# EAGLE design Declan (EAGLE 7.5.0)
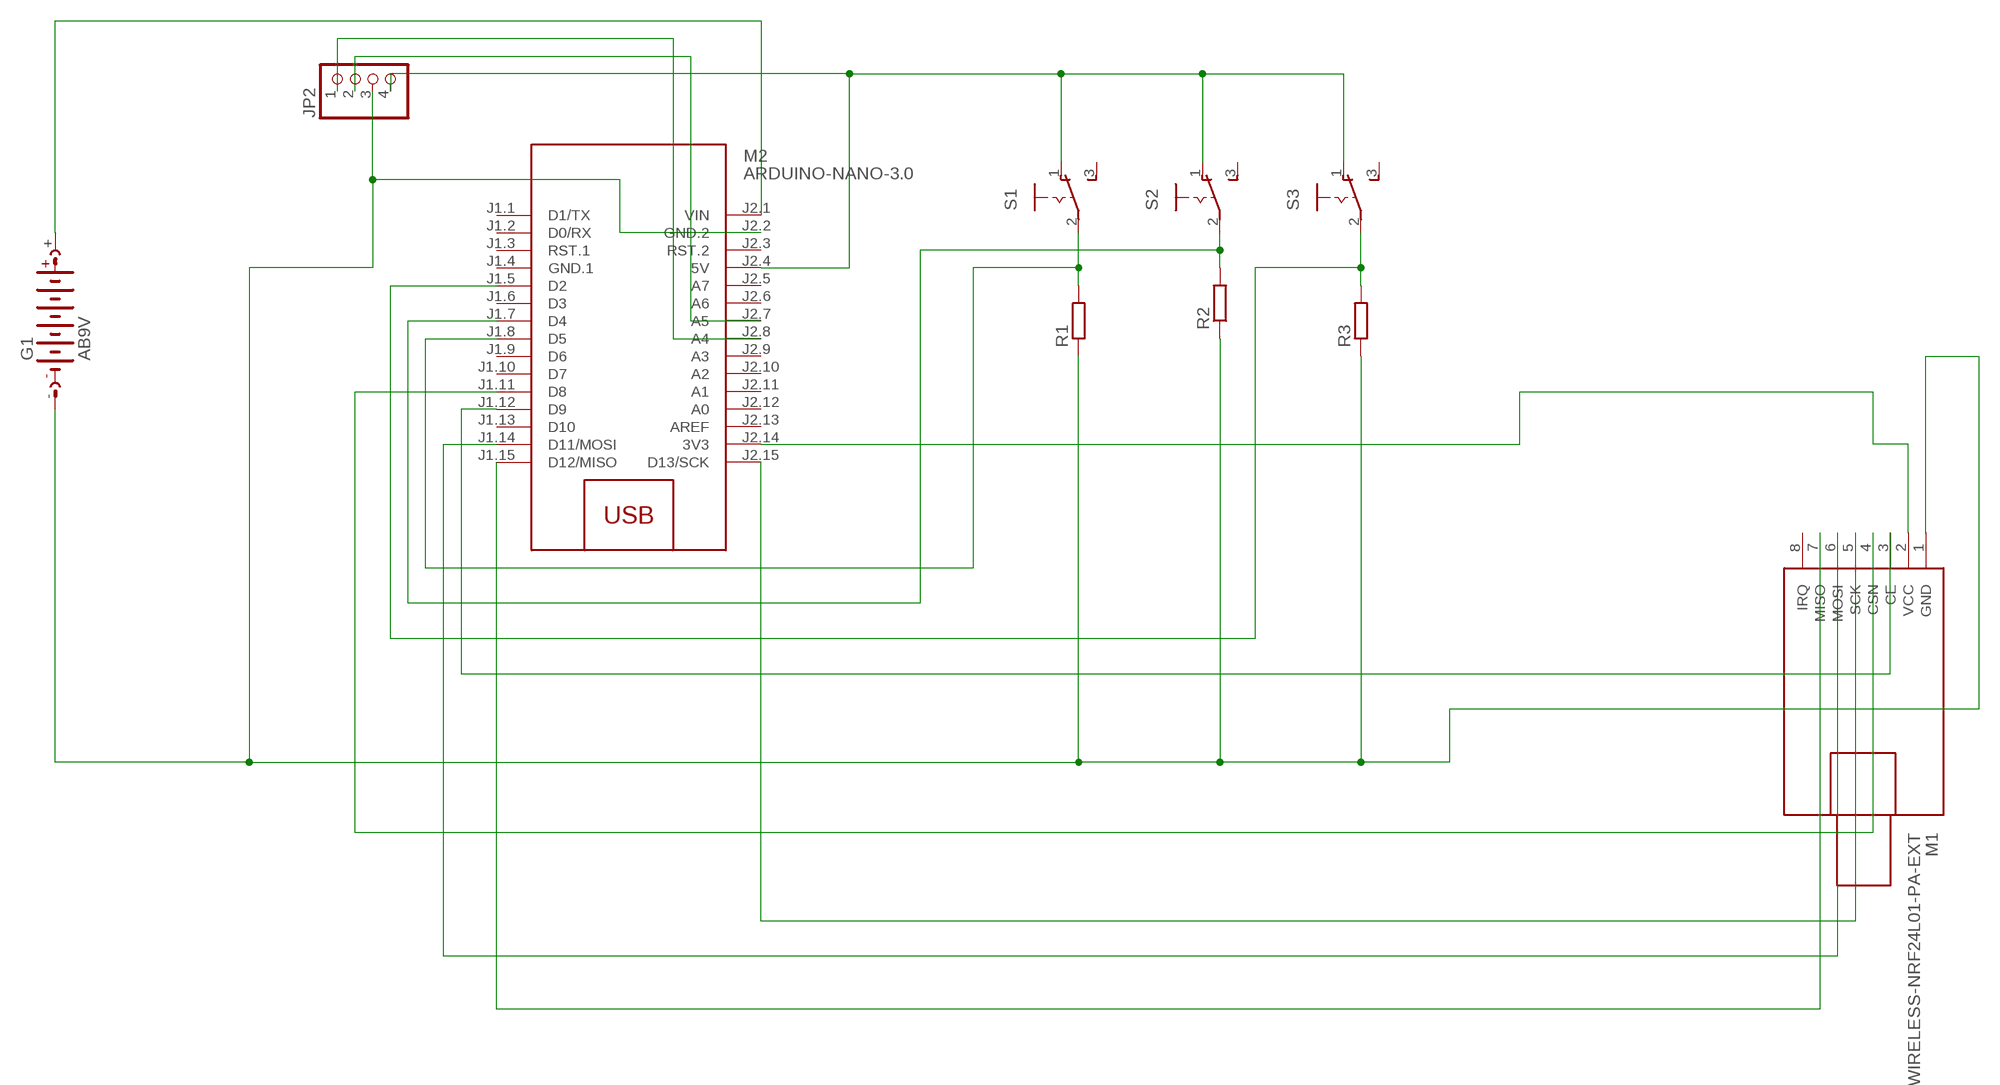
[diagram p0: schematic, sheet 1]

## Parts
G1  AB9V  [AB9V]
JP2  PINHD-1X4  [1X04]
M1  WIRELESS-NRF24L01-PA-EXT  [WIRELESS-NRF24L01-PA-EXT]
M2  ARDUINO-NANO-3.0  [ARDUINO-NANO-3.0]
R1  R-EU_0207/10  [0207/10]
R2  R-EU_0207/10  [0207/10]
R3  R-EU_0207/10  [0207/10]
S1  255SB  [255SB]
S2  255SB  [255SB]
S3  255SB  [255SB]

## Nets
N$1: JP2.2 M2.J2.7(A5)
N$2: JP2.1 M2.J2.8(A4)
N$5: G1.- JP2.3 M1.1(GND) M2.J2.2(GND.2) R1.1 R2.1 R3.1
N$6: JP2.4 M2.J2.4(5V) S1.1(O) S2.1(O) S3.1(O)
N$7: M2.J1.8(D5) R1.2 S1.2(P)
N$8: M2.J1.7(D4) R2.2 S2.2(P)
N$9: M2.J1.5(D2) R3.2 S3.2(P)
N$10: G1.+ M2.J2.1(VIN)
N$11: M1.2(VCC) M2.J2.14(3V3)
N$13: M1.3(CE) M2.J1.12(D9)
N$14: M1.4(CSN) M2.J1.11(D8)
N$15: M1.5(SCK) M2.J2.15(D13/SCK)
N$16: M1.6(MOSI) M2.J1.14(D11/MOSI)
N$17: M1.7(MISO) M2.J1.15(D12/MISO)
Unconnected: M1.8(IRQ) M2.J1.1(D1/TX) M2.J1.2(D0/RX) M2.J1.3(RST.1) M2.J1.6(D3) M2.J1.9(D6) M2.J1.10(D7) M2.J1.13(D10) M2.J2.3(RST.2) M2.J2.5(A7) M2.J2.6(A6) M2.J2.9(A3) M2.J2.10(A2) M2.J2.11(A1) M2.J2.12(A0) M2.J2.13(AREF) S1.3(S) S2.3(S) S3.3(S)

## Power pins joined to a net without a drawn wire
GND.1: M2.J1.4(GND.1)

## Library data of the parts
G1 = battery:AB9V: 9-V BATTERY CLIP
JP2 = pinhead:PINHD-1X4: PIN HEADER
M1 = diy-modules:WIRELESS-NRF24L01-PA-EXT: 2.4 GHz Wireless Module based on NRF24L01 chip with preamplifier and external antenna Click here to find device on ebay.com <http://www.ebay.com/sch/nrf24l01+pa+lna+sma>
M2 = diy-modules:ARDUINO-NANO-3.0: Arduino Nano 3.0 and compatible devices More details available here: https://www.arduino.cc/en/Main/ArduinoBoardNano Click here to find device on ebay.com <http://www.ebay.com/sch/arduino+nano>
R1-R3 = resistor:R-EU_: RESISTOR, European symbol
S1-S3 = switch:255SB: SLIDING SWITCH Distributor Buerklin, 11G810

## Board
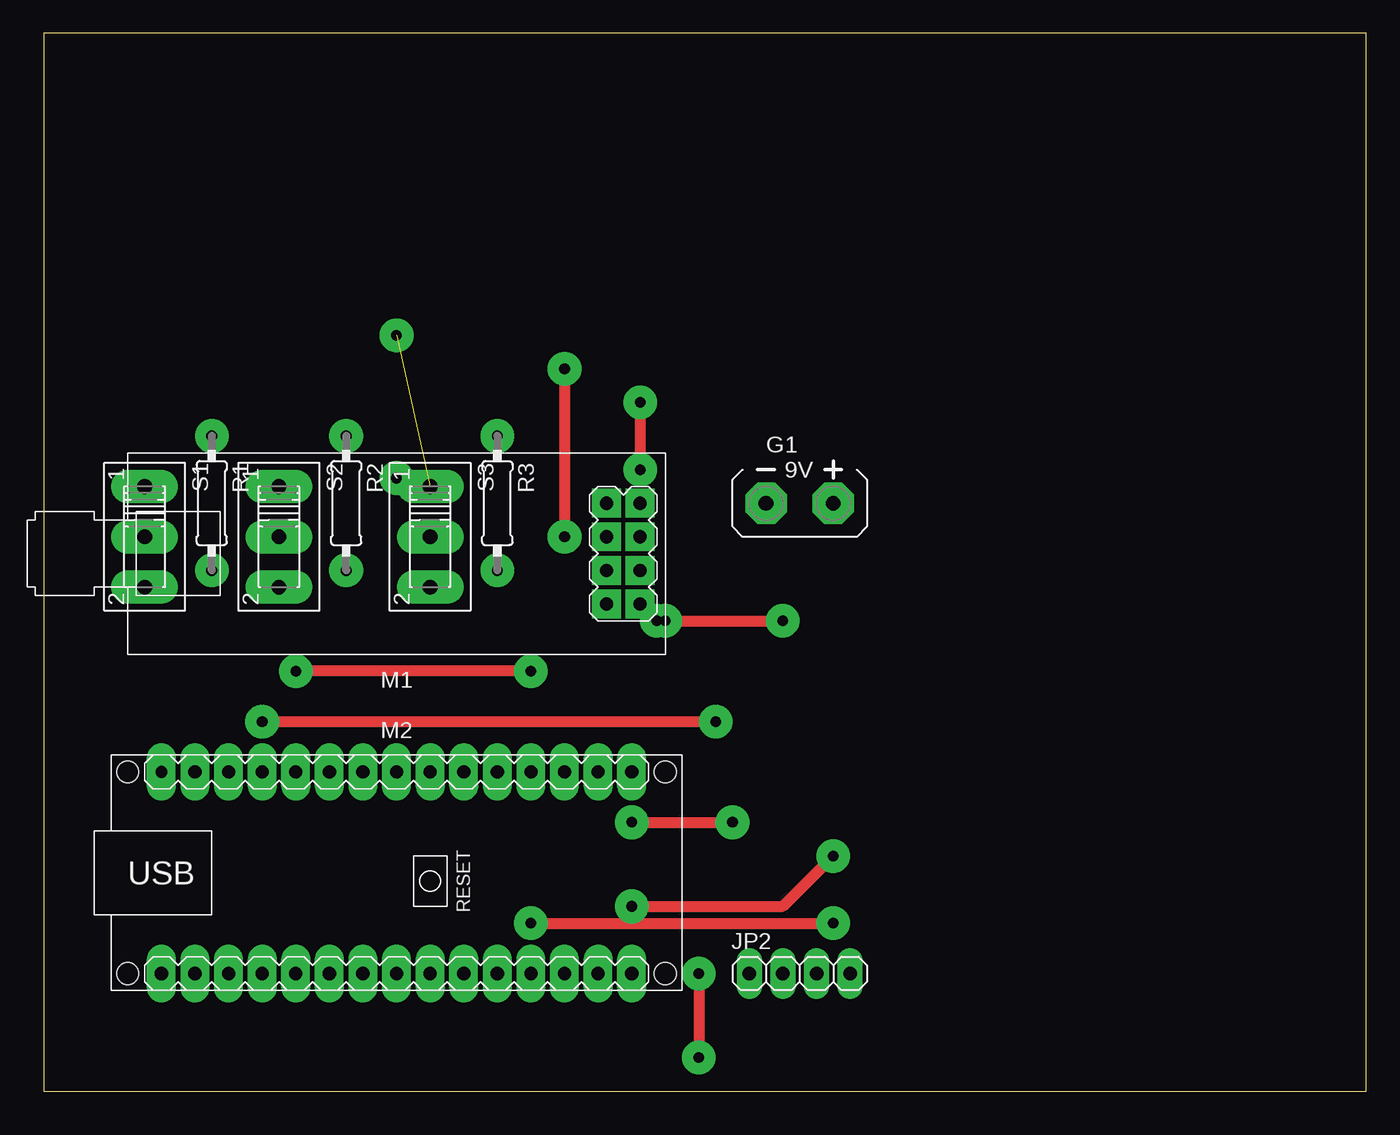
[diagram p1: board, top side]
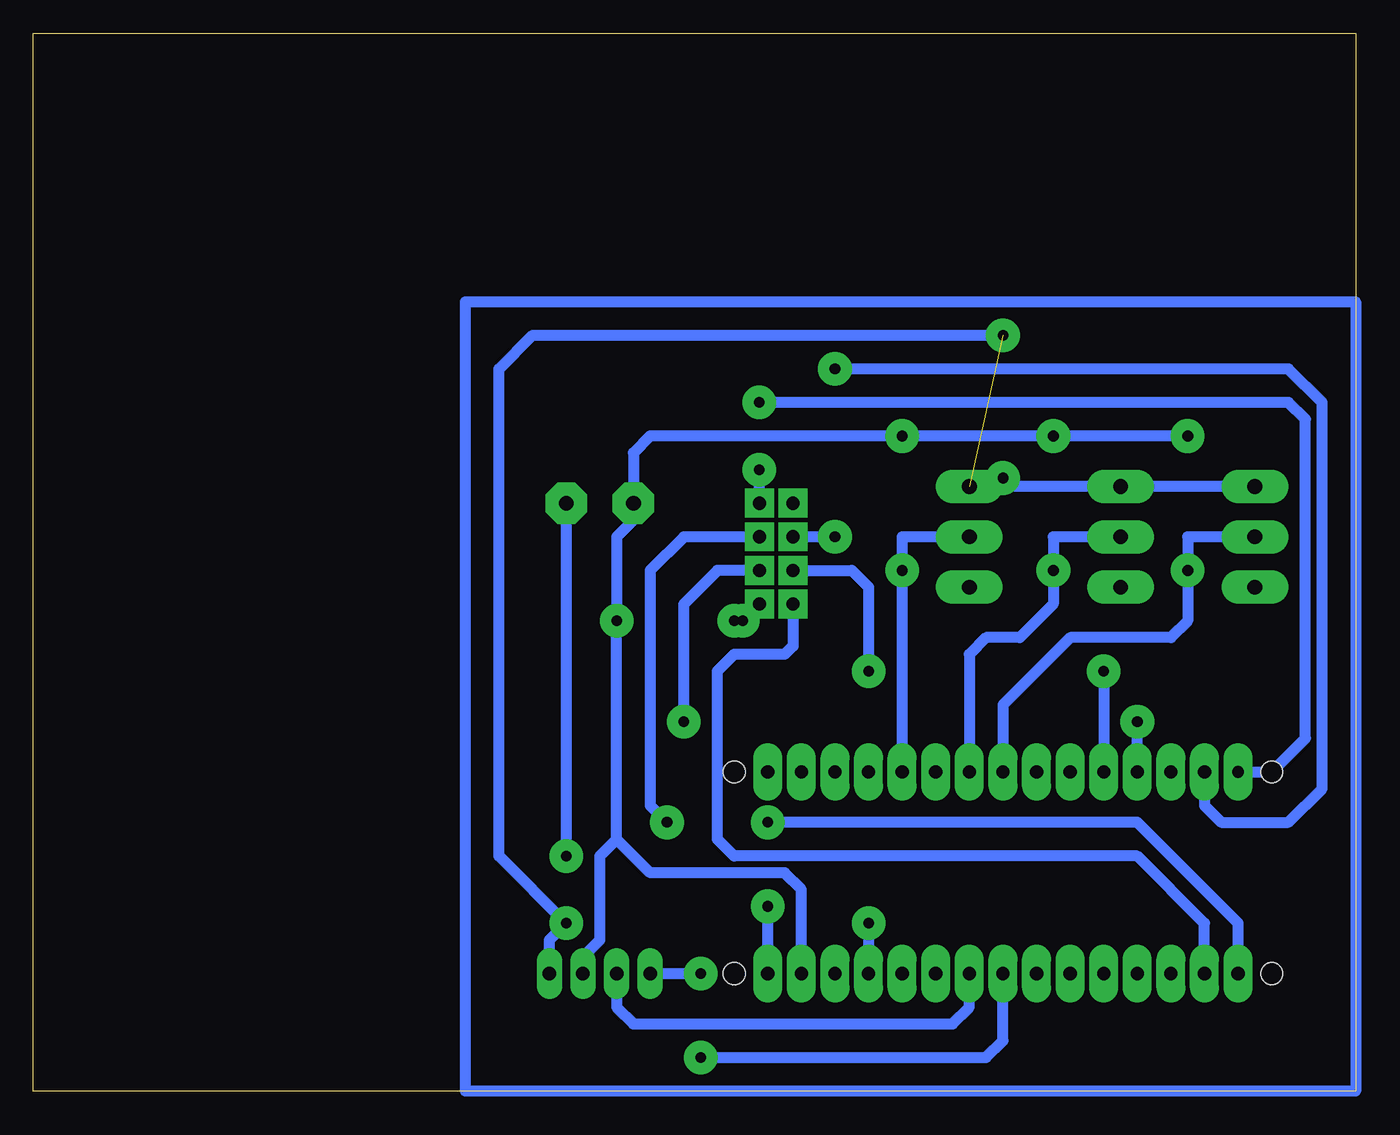
[diagram p2: board, bottom side, seen from below]

Size 100 x 80 mm. Coordinates in mm from the lower left corner, seen from the top.
Outline: 0,0 100,0 100,80 0,80 0,0
Copper layers (1*16): Top 0.035mm / dielectric 1.5mm / Bottom 0.035mm
Design rules "default": minimum track width 10mil, minimum drill 24mil, track to track 8mil, track to pad 8mil, pad to pad 8mil, via to via 8mil, smd to smd 8mil, copper to edge 40mil, drill to drill 8mil, minimum pad ring 10mil, minimum via ring 8mil, stop-mask expansion 4mil, vias tented up to drill 0mil, thermal gap 10mil

### Footprints (pad centres in the part's own frame; a part is rotated, then mirrored left to right if it is on the bottom)
AB9V = drill 1.118 pad 3.15 octagon: + 0,2.54; - 0,-2.54
1X04 = drill 1.016 pad 1.93 long: 1 -3.81,0; 3 1.27,0; 5 -1.27,0; 6 1.27,0; 7 3.81,0 | drill 1.016 long: 2 -1.27,0; 4 3.81,0
WIRELESS-NRF24L01-PA-EXT = drill 1 pad 2.184 square: 1 -18.415,3.81; 2 -15.875,3.81; 3 -18.415,1.27; 4 -15.875,1.27; 5 -18.415,-1.27; 6 -15.875,-1.27; 7 -18.415,-3.81; 8 -15.875,-3.81
ARDUINO-NANO-3.0 = drill 1 square: J1.1 17.78,7.62 | drill 1: J1.2 15.24,7.62; J1.3 12.7,7.62; J1.4 10.16,7.62; J1.5 7.62,7.62; J1.6 5.08,7.62; J1.7 2.54,7.62; J1.8 0,7.62; J1.9 -2.54,7.62; J1.10 -5.08,7.62; J1.11 -7.62,7.62; J1.12 -10.16,7.62; J1.14 -15.24,7.62; J2.1 17.78,-7.62; J2.2 15.24,-7.62; J2.3 12.7,-7.62; J2.4 10.16,-7.62; J2.5 7.62,-7.62; J2.6 5.08,-7.62; J2.7 2.54,-7.62; J2.8 0,-7.62; J2.9 -2.54,-7.62; J2.11 -7.62,-7.62; J2.12 -10.16,-7.62; J2.13 -12.7,-7.62; J2.14 -15.24,-7.62; J2.15 -17.78,-7.62 | drill 1 long: J1.13 -12.7,7.62; J2.10 -5.08,-7.62 | drill 0.9 pad 2.184 long: J1.15 -17.78,7.62; J1.16 -15.24,7.62; J1.17 -12.7,7.62; J1.18 -10.16,7.62; J1.19 -7.62,7.62; J1.20 -5.08,7.62; J1.21 -2.54,7.62; J1.22 0,7.62; J1.23 2.54,7.62; J1.24 5.08,7.62; J1.25 7.62,7.62; J1.26 10.16,7.62; J1.27 12.7,7.62; J1.28 15.24,7.62; J1.29 17.78,7.62; J1.30 -17.78,-7.62; J1.31 -15.24,-7.62; J1.32 -12.7,-7.62; J1.33 -10.16,-7.62; J1.34 -7.62,-7.62; J1.35 -5.08,-7.62; J1.36 -2.54,-7.62; J1.37 0,-7.62; J1.38 2.54,-7.62; J1.39 5.08,-7.62; J1.40 7.62,-7.62; J1.41 10.16,-7.62; J1.42 12.7,-7.62; J1.43 15.24,-7.62; J1.44 17.78,-7.62 | hole 1.651: -20.32,7.62; -20.32,-7.62; 20.32,-7.62; 20.32,7.62
0207/10 = drill 0.813 pad 2.54: 1 -5.08,0; 3 5.08,0 | drill 0.813 octagon: 2 5.08,0
255SB = drill 1.118 pad 2.54 long: 1 -3.81,0; 4 0,0; 5 3.81,0 | drill 1.118 long: 2 0,0; 3 3.81,0

### Placement (x,y rotation side)
G1  57.15,44.45 270 top
JP2  57.15,8.89 0 top
M1  26.67,40.64 180 top
M2  26.67,16.51 0 top
R1  12.7,44.45 270 top
R2  22.86,44.45 270 top
R3  34.29,44.45 270 top
S1  7.62,41.91 270 top
S2  17.78,41.91 270 top
S3  29.21,41.91 270 top

### Tracks (layer width: path | path; a pad name or v marks a point on that pad's centre or on a via)
N$1
  Bottom 0.813: JP2.2 55.88,6.35 54.61,5.08 30.48,5.08 29.21,6.35 M2.J2.7
N$2  (via drill 0.8 pad 2.54)
  Top 0.813: v49.53,8.89 v49.53,2.54
  Bottom 0.813: JP2.1 v49.53,8.89 | v49.53,2.54 27.94,2.54 26.67,3.81 M2.J2.8
N$3  (via drill 0.8 pad 2.54)
  other vias: 46.99,35.56
N$4  (via drill 0.8 pad 2.54)
  other vias: 26.67,46.35
N$5  (via drill 0.8 pad 2.54)
  Top 0.813: v46.35,35.56 v55.88,35.56
  Bottom 0.813: R1.1 R2.1 R3.1 53.34,49.53 54.61,48.26 G1.- 54.61,43.18 55.88,41.91 v55.88,35.56 55.88,19.05 | M2.J2.2 41.91,15.24 43.18,16.51 53.34,16.51 55.88,19.05 | v46.35,35.56 M1.1 | JP2.3 58.42,10.16 57.15,11.43 57.15,17.78 55.88,19.05
N$6  (via drill 0.8 pad 2.54)  (1 unrouted)
  Top 0.813: v36.83,12.7 v59.69,12.7
  Bottom 0.813: S1.1 S2.1 S3.1 | JP2.4 60.96,11.43 v59.69,12.7 64.77,17.78 64.77,54.61 62.23,57.15 26.67,57.15 | v36.83,12.7 M2.J2.4
N$7
  Bottom 0.813: S1.2 12.7,41.91 R1.2 12.7,35.56 13.97,34.29 21.59,34.29 26.67,29.21 M2.J1.8
N$8
  Bottom 0.813: S2.2 22.86,41.91 R2.2 22.86,36.83 25.4,34.29 27.94,34.29 29.21,33.02 M2.J1.7
N$9
  Bottom 0.813: S3.2 34.29,41.91 R3.2 M2.J1.5
N$10  (via drill 0.8 pad 2.54)
  Top 0.813: v44.45,13.97 55.88,13.97 v59.69,17.78
  Bottom 0.813: G1.+ v59.69,17.78 | M2.J2.1 v44.45,13.97
N$11
  Bottom 0.813: M2.J2.14 11.43,12.7 16.51,17.78 46.99,17.78 48.26,19.05 48.26,31.75 46.99,33.02 43.18,33.02 42.55,33.66 M1.2
N$12  (via drill 0.8 pad 2.54)
  other vias: 26.67,57.15
N$13  (via drill 0.8 pad 2.54)
  Top 0.813: v16.51,27.94 v50.8,27.94
  Bottom 0.813: M1.3 48.26,39.37 50.8,36.83 v50.8,27.94 | M2.J1.12 v16.51,27.94
N$14  (via drill 0.8 pad 2.54)
  Top 0.813: v36.83,31.75 v19.05,31.75
  Bottom 0.813: M1.4 38.1,39.37 36.83,38.1 v36.83,31.75 | v19.05,31.75 M2.J1.11
N$15  (via drill 0.8 pad 2.54)
  Top 0.813: v44.45,20.32 v52.07,20.32
  Bottom 0.813: M2.J2.15 8.89,12.7 16.51,20.32 v44.45,20.32 | M1.5 50.8,41.91 53.34,39.37 53.34,21.59 v52.07,20.32
N$16  (via drill 0.8 pad 2.54)
  Top 0.813: v39.37,54.61 v39.37,41.91
  Bottom 0.813: M2.J1.14 11.43,21.59 10.16,20.32 5.08,20.32 2.54,22.86 2.54,52.07 5.08,54.61 v39.37,54.61 | v39.37,41.91 M1.6
N$17  (via drill 0.8 pad 2.54)
  Top 0.813: v45.09,52.07 v45.09,46.99
  Bottom 0.813: M1.7 v45.09,46.99 | M2.J1.15 6.35,24.13 3.81,26.67 3.81,50.8 5.08,52.07 v45.09,52.07
N$18
  Bottom 0.813: 0,0 67.31,0 67.31,59.69 0,59.69 0,0